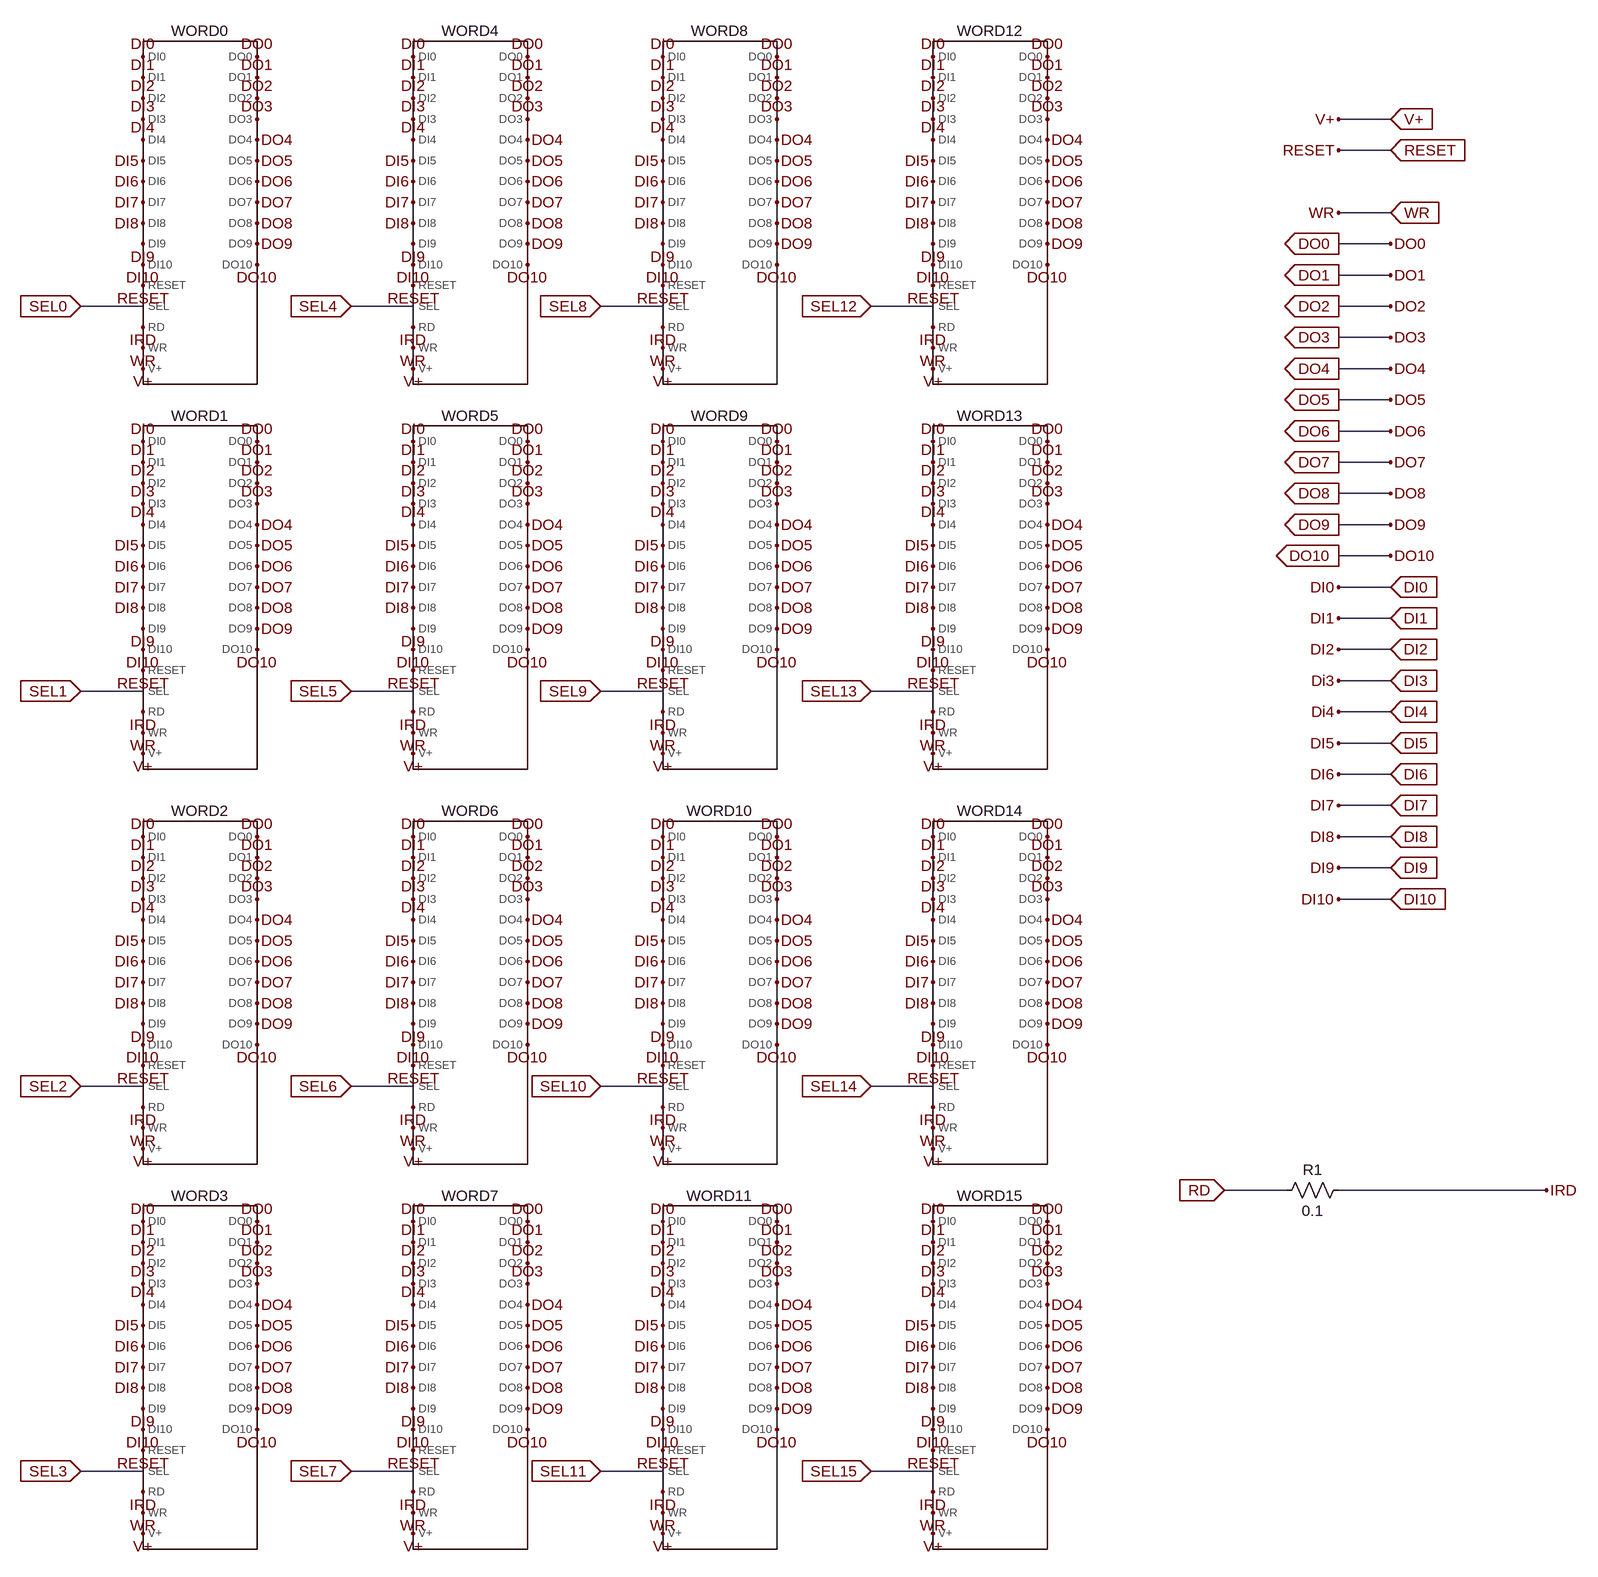
[diagram p0: schematic PMemBoard.asc]
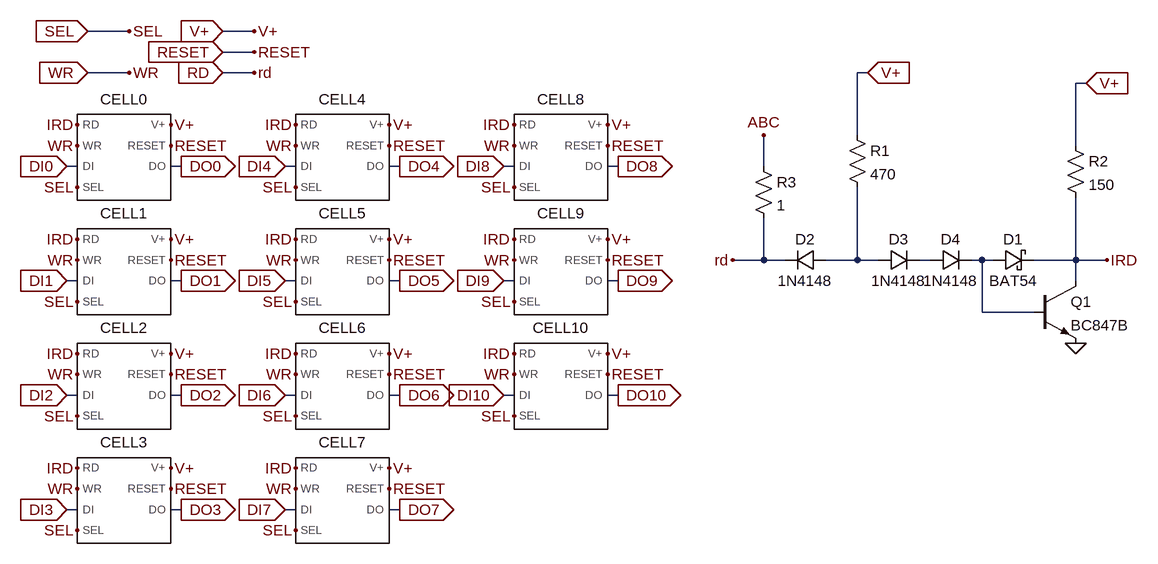
[diagram p1: sub-circuit pmemword.asc]
PMemBoard.asc, the LTspice schematic file:
Version 4
SHEET 1 2448 2400
WIRE 2128 176 2048 176
WIRE 2128 224 2048 224
WIRE 2128 320 2048 320
WIRE 2128 368 2048 368
WIRE 2128 416 2048 416
WIRE 208 464 112 464
WIRE 624 464 528 464
WIRE 1008 464 912 464
WIRE 1424 464 1328 464
WIRE 2128 464 2048 464
WIRE 2128 512 2048 512
WIRE 2128 560 2048 560
WIRE 2128 608 2048 608
WIRE 2128 656 2048 656
WIRE 2128 704 2048 704
WIRE 2128 752 2048 752
WIRE 2128 800 2048 800
WIRE 2128 848 2048 848
WIRE 2128 896 2048 896
WIRE 2128 944 2048 944
WIRE 2128 992 2048 992
WIRE 2128 1040 2048 1040
WIRE 208 1056 112 1056
WIRE 624 1056 528 1056
WIRE 1008 1056 912 1056
WIRE 1424 1056 1328 1056
WIRE 2128 1088 2048 1088
WIRE 2128 1136 2048 1136
WIRE 2128 1184 2048 1184
WIRE 2128 1232 2048 1232
WIRE 2128 1280 2048 1280
WIRE 2128 1328 2048 1328
WIRE 2128 1376 2048 1376
WIRE 208 1664 112 1664
WIRE 624 1664 528 1664
WIRE 1008 1664 912 1664
WIRE 1424 1664 1328 1664
WIRE 1968 1824 1872 1824
WIRE 2368 1824 2048 1824
WIRE 208 2256 112 2256
WIRE 624 2256 528 2256
WIRE 1008 2256 912 2256
WIRE 1424 2256 1328 2256
FLAG 208 560 V+
FLAG 208 432 RESET
FLAG 208 528 WR
FLAG 208 80 DI0
FLAG 208 112 DI1
FLAG 208 144 DI2
FLAG 208 176 DI3
FLAG 208 208 DI4
FLAG 208 240 DI5
FLAG 208 272 DI6
FLAG 208 304 DI7
FLAG 208 336 DI8
FLAG 208 368 DI9
FLAG 208 400 DI10
FLAG 384 80 DO0
FLAG 384 112 DO1
FLAG 384 144 DO2
FLAG 384 176 DO3
FLAG 384 208 DO4
FLAG 384 240 DO5
FLAG 384 272 DO6
FLAG 384 304 DO7
FLAG 384 336 DO8
FLAG 384 368 DO9
FLAG 384 400 DO10
FLAG 208 1152 V+
FLAG 208 1024 RESET
FLAG 208 1120 WR
FLAG 208 672 DI0
FLAG 208 704 DI1
FLAG 208 736 DI2
FLAG 208 768 DI3
FLAG 208 800 DI4
FLAG 208 832 DI5
FLAG 208 864 DI6
FLAG 208 896 DI7
FLAG 208 928 DI8
FLAG 208 960 DI9
FLAG 208 992 DI10
FLAG 384 672 DO0
FLAG 384 704 DO1
FLAG 384 736 DO2
FLAG 384 768 DO3
FLAG 384 800 DO4
FLAG 384 832 DO5
FLAG 384 864 DO6
FLAG 384 896 DO7
FLAG 384 928 DO8
FLAG 384 960 DO9
FLAG 384 992 DO10
FLAG 208 1760 V+
FLAG 208 1632 RESET
FLAG 208 1728 WR
FLAG 208 1280 DI0
FLAG 208 1312 DI1
FLAG 208 1344 DI2
FLAG 208 1376 DI3
FLAG 208 1408 DI4
FLAG 208 1440 DI5
FLAG 208 1472 DI6
FLAG 208 1504 DI7
FLAG 208 1536 DI8
FLAG 208 1568 DI9
FLAG 208 1600 DI10
FLAG 384 1280 DO0
FLAG 384 1312 DO1
FLAG 384 1344 DO2
FLAG 384 1376 DO3
FLAG 384 1408 DO4
FLAG 384 1440 DO5
FLAG 384 1472 DO6
FLAG 384 1504 DO7
FLAG 384 1536 DO8
FLAG 384 1568 DO9
FLAG 384 1600 DO10
FLAG 208 2352 V+
FLAG 208 2224 RESET
FLAG 208 2320 WR
FLAG 208 1872 DI0
FLAG 208 1904 DI1
FLAG 208 1936 DI2
FLAG 208 1968 DI3
FLAG 208 2000 DI4
FLAG 208 2032 DI5
FLAG 208 2064 DI6
FLAG 208 2096 DI7
FLAG 208 2128 DI8
FLAG 208 2160 DI9
FLAG 208 2192 DI10
FLAG 384 1872 DO0
FLAG 384 1904 DO1
FLAG 384 1936 DO2
FLAG 384 1968 DO3
FLAG 384 2000 DO4
FLAG 384 2032 DO5
FLAG 384 2064 DO6
FLAG 384 2096 DO7
FLAG 384 2128 DO8
FLAG 384 2160 DO9
FLAG 384 2192 DO10
FLAG 624 560 V+
FLAG 624 432 RESET
FLAG 624 528 WR
FLAG 624 80 DI0
FLAG 624 112 DI1
FLAG 624 144 DI2
FLAG 624 176 DI3
FLAG 624 208 DI4
FLAG 624 240 DI5
FLAG 624 272 DI6
FLAG 624 304 DI7
FLAG 624 336 DI8
FLAG 624 368 DI9
FLAG 624 400 DI10
FLAG 800 80 DO0
FLAG 800 112 DO1
FLAG 800 144 DO2
FLAG 800 176 DO3
FLAG 800 208 DO4
FLAG 800 240 DO5
FLAG 800 272 DO6
FLAG 800 304 DO7
FLAG 800 336 DO8
FLAG 800 368 DO9
FLAG 800 400 DO10
FLAG 624 1152 V+
FLAG 624 1024 RESET
FLAG 624 1120 WR
FLAG 624 672 DI0
FLAG 624 704 DI1
FLAG 624 736 DI2
FLAG 624 768 DI3
FLAG 624 800 DI4
FLAG 624 832 DI5
FLAG 624 864 DI6
FLAG 624 896 DI7
FLAG 624 928 DI8
FLAG 624 960 DI9
FLAG 624 992 DI10
FLAG 800 672 DO0
FLAG 800 704 DO1
FLAG 800 736 DO2
FLAG 800 768 DO3
FLAG 800 800 DO4
FLAG 800 832 DO5
FLAG 800 864 DO6
FLAG 800 896 DO7
FLAG 800 928 DO8
FLAG 800 960 DO9
FLAG 800 992 DO10
FLAG 624 1760 V+
FLAG 624 1632 RESET
FLAG 624 1728 WR
FLAG 624 1280 DI0
FLAG 624 1312 DI1
FLAG 624 1344 DI2
FLAG 624 1376 DI3
FLAG 624 1408 DI4
FLAG 624 1440 DI5
FLAG 624 1472 DI6
FLAG 624 1504 DI7
FLAG 624 1536 DI8
FLAG 624 1568 DI9
FLAG 624 1600 DI10
FLAG 800 1280 DO0
FLAG 800 1312 DO1
FLAG 800 1344 DO2
FLAG 800 1376 DO3
FLAG 800 1408 DO4
FLAG 800 1440 DO5
FLAG 800 1472 DO6
FLAG 800 1504 DO7
FLAG 800 1536 DO8
FLAG 800 1568 DO9
FLAG 800 1600 DO10
FLAG 624 2352 V+
FLAG 624 2224 RESET
FLAG 624 2320 WR
FLAG 624 1872 DI0
FLAG 624 1904 DI1
FLAG 624 1936 DI2
FLAG 624 1968 DI3
FLAG 624 2000 DI4
FLAG 624 2032 DI5
FLAG 624 2064 DI6
FLAG 624 2096 DI7
FLAG 624 2128 DI8
FLAG 624 2160 DI9
FLAG 624 2192 DI10
FLAG 800 1872 DO0
FLAG 800 1904 DO1
FLAG 800 1936 DO2
FLAG 800 1968 DO3
FLAG 800 2000 DO4
FLAG 800 2032 DO5
FLAG 800 2064 DO6
FLAG 800 2096 DO7
FLAG 800 2128 DO8
FLAG 800 2160 DO9
FLAG 800 2192 DO10
FLAG 1008 560 V+
FLAG 1008 432 RESET
FLAG 1008 528 WR
FLAG 1008 80 DI0
FLAG 1008 112 DI1
FLAG 1008 144 DI2
FLAG 1008 176 DI3
FLAG 1008 208 DI4
FLAG 1008 240 DI5
FLAG 1008 272 DI6
FLAG 1008 304 DI7
FLAG 1008 336 DI8
FLAG 1008 368 DI9
FLAG 1008 400 DI10
FLAG 1184 80 DO0
FLAG 1184 112 DO1
FLAG 1184 144 DO2
FLAG 1184 176 DO3
FLAG 1184 208 DO4
FLAG 1184 240 DO5
FLAG 1184 272 DO6
FLAG 1184 304 DO7
FLAG 1184 336 DO8
FLAG 1184 368 DO9
FLAG 1184 400 DO10
FLAG 1008 1152 V+
FLAG 1008 1024 RESET
FLAG 1008 1120 WR
FLAG 1008 672 DI0
FLAG 1008 704 DI1
FLAG 1008 736 DI2
FLAG 1008 768 DI3
FLAG 1008 800 DI4
FLAG 1008 832 DI5
FLAG 1008 864 DI6
FLAG 1008 896 DI7
FLAG 1008 928 DI8
FLAG 1008 960 DI9
FLAG 1008 992 DI10
FLAG 1184 672 DO0
FLAG 1184 704 DO1
FLAG 1184 736 DO2
FLAG 1184 768 DO3
FLAG 1184 800 DO4
FLAG 1184 832 DO5
FLAG 1184 864 DO6
FLAG 1184 896 DO7
FLAG 1184 928 DO8
FLAG 1184 960 DO9
FLAG 1184 992 DO10
FLAG 1008 1760 V+
FLAG 1008 1632 RESET
FLAG 1008 1728 WR
FLAG 1008 1280 DI0
FLAG 1008 1312 DI1
FLAG 1008 1344 DI2
FLAG 1008 1376 DI3
FLAG 1008 1408 DI4
FLAG 1008 1440 DI5
FLAG 1008 1472 DI6
FLAG 1008 1504 DI7
FLAG 1008 1536 DI8
FLAG 1008 1568 DI9
FLAG 1008 1600 DI10
FLAG 1184 1280 DO0
FLAG 1184 1312 DO1
FLAG 1184 1344 DO2
FLAG 1184 1376 DO3
FLAG 1184 1408 DO4
FLAG 1184 1440 DO5
FLAG 1184 1472 DO6
FLAG 1184 1504 DO7
FLAG 1184 1536 DO8
FLAG 1184 1568 DO9
FLAG 1184 1600 DO10
FLAG 1008 2352 V+
FLAG 1008 2224 RESET
FLAG 1008 2320 WR
FLAG 1008 1872 DI0
FLAG 1008 1904 DI1
FLAG 1008 1936 DI2
FLAG 1008 1968 DI3
FLAG 1008 2000 DI4
FLAG 1008 2032 DI5
FLAG 1008 2064 DI6
FLAG 1008 2096 DI7
FLAG 1008 2128 DI8
FLAG 1008 2160 DI9
FLAG 1008 2192 DI10
FLAG 1184 1872 DO0
FLAG 1184 1904 DO1
FLAG 1184 1936 DO2
FLAG 1184 1968 DO3
FLAG 1184 2000 DO4
FLAG 1184 2032 DO5
FLAG 1184 2064 DO6
FLAG 1184 2096 DO7
FLAG 1184 2128 DO8
FLAG 1184 2160 DO9
FLAG 1184 2192 DO10
FLAG 1424 560 V+
FLAG 1424 432 RESET
FLAG 1424 528 WR
FLAG 1424 80 DI0
FLAG 1424 112 DI1
FLAG 1424 144 DI2
FLAG 1424 176 DI3
FLAG 1424 208 DI4
FLAG 1424 240 DI5
FLAG 1424 272 DI6
FLAG 1424 304 DI7
FLAG 1424 336 DI8
FLAG 1424 368 DI9
FLAG 1424 400 DI10
FLAG 1600 80 DO0
FLAG 1600 112 DO1
FLAG 1600 144 DO2
FLAG 1600 176 DO3
FLAG 1600 208 DO4
FLAG 1600 240 DO5
FLAG 1600 272 DO6
FLAG 1600 304 DO7
FLAG 1600 336 DO8
FLAG 1600 368 DO9
FLAG 1600 400 DO10
FLAG 1424 1152 V+
FLAG 1424 1024 RESET
FLAG 1424 1120 WR
FLAG 1424 672 DI0
FLAG 1424 704 DI1
FLAG 1424 736 DI2
FLAG 1424 768 DI3
FLAG 1424 800 DI4
FLAG 1424 832 DI5
FLAG 1424 864 DI6
FLAG 1424 896 DI7
FLAG 1424 928 DI8
FLAG 1424 960 DI9
FLAG 1424 992 DI10
FLAG 1600 672 DO0
FLAG 1600 704 DO1
FLAG 1600 736 DO2
FLAG 1600 768 DO3
FLAG 1600 800 DO4
FLAG 1600 832 DO5
FLAG 1600 864 DO6
FLAG 1600 896 DO7
FLAG 1600 928 DO8
FLAG 1600 960 DO9
FLAG 1600 992 DO10
FLAG 1424 1760 V+
FLAG 1424 1632 RESET
FLAG 1424 1728 WR
FLAG 1424 1280 DI0
FLAG 1424 1312 DI1
FLAG 1424 1344 DI2
FLAG 1424 1376 DI3
FLAG 1424 1408 DI4
FLAG 1424 1440 DI5
FLAG 1424 1472 DI6
FLAG 1424 1504 DI7
FLAG 1424 1536 DI8
FLAG 1424 1568 DI9
FLAG 1424 1600 DI10
FLAG 1600 1280 DO0
FLAG 1600 1312 DO1
FLAG 1600 1344 DO2
FLAG 1600 1376 DO3
FLAG 1600 1408 DO4
FLAG 1600 1440 DO5
FLAG 1600 1472 DO6
FLAG 1600 1504 DO7
FLAG 1600 1536 DO8
FLAG 1600 1568 DO9
FLAG 1600 1600 DO10
FLAG 1424 2352 V+
FLAG 1424 2224 RESET
FLAG 1424 2320 WR
FLAG 1424 1872 DI0
FLAG 1424 1904 DI1
FLAG 1424 1936 DI2
FLAG 1424 1968 DI3
FLAG 1424 2000 DI4
FLAG 1424 2032 DI5
FLAG 1424 2064 DI6
FLAG 1424 2096 DI7
FLAG 1424 2128 DI8
FLAG 1424 2160 DI9
FLAG 1424 2192 DI10
FLAG 1600 1872 DO0
FLAG 1600 1904 DO1
FLAG 1600 1936 DO2
FLAG 1600 1968 DO3
FLAG 1600 2000 DO4
FLAG 1600 2032 DO5
FLAG 1600 2064 DO6
FLAG 1600 2096 DO7
FLAG 1600 2128 DO8
FLAG 1600 2160 DO9
FLAG 1600 2192 DO10
FLAG 2048 176 V+
FLAG 2128 176 V+
IOPIN 2128 176 In
FLAG 2048 224 RESET
FLAG 2128 224 RESET
IOPIN 2128 224 In
FLAG 1872 1824 RD
IOPIN 1872 1824 In
FLAG 2048 320 WR
FLAG 2128 320 WR
IOPIN 2128 320 In
FLAG 2048 368 DO0
IOPIN 2048 368 Out
FLAG 2128 368 DO0
FLAG 2048 416 DO1
IOPIN 2048 416 Out
FLAG 2128 416 DO1
FLAG 2048 464 DO2
IOPIN 2048 464 Out
FLAG 2128 464 DO2
FLAG 2048 512 DO3
IOPIN 2048 512 Out
FLAG 2128 512 DO3
FLAG 2048 560 DO4
IOPIN 2048 560 Out
FLAG 2128 560 DO4
FLAG 2048 608 DO5
IOPIN 2048 608 Out
FLAG 2128 608 DO5
FLAG 2048 656 DO6
IOPIN 2048 656 Out
FLAG 2128 656 DO6
FLAG 2048 704 DO7
IOPIN 2048 704 Out
FLAG 2128 704 DO7
FLAG 2048 752 DO8
IOPIN 2048 752 Out
FLAG 2128 752 DO8
FLAG 2048 800 DO9
IOPIN 2048 800 Out
FLAG 2128 800 DO9
FLAG 2048 848 DO10
IOPIN 2048 848 Out
FLAG 2128 848 DO10
FLAG 2048 896 DI0
FLAG 2128 896 DI0
IOPIN 2128 896 In
FLAG 2048 944 DI1
FLAG 2128 944 DI1
IOPIN 2128 944 In
FLAG 2048 992 DI2
FLAG 2128 992 DI2
IOPIN 2128 992 In
FLAG 2048 1040 Di3
FLAG 2128 1040 DI3
IOPIN 2128 1040 In
FLAG 2048 1088 Di4
FLAG 2128 1088 DI4
IOPIN 2128 1088 In
FLAG 2048 1136 DI5
FLAG 2128 1136 DI5
IOPIN 2128 1136 In
FLAG 2048 1184 DI6
FLAG 2128 1184 DI6
IOPIN 2128 1184 In
FLAG 2048 1232 DI7
FLAG 2128 1232 DI7
IOPIN 2128 1232 In
FLAG 2048 1280 DI8
FLAG 2128 1280 DI8
IOPIN 2128 1280 In
FLAG 2048 1328 DI9
FLAG 2128 1328 DI9
IOPIN 2128 1328 In
FLAG 2048 1376 DI10
FLAG 2128 1376 DI10
IOPIN 2128 1376 In
FLAG 112 464 SEL0
IOPIN 112 464 In
FLAG 112 1056 SEL1
IOPIN 112 1056 In
FLAG 112 1664 SEL2
IOPIN 112 1664 In
FLAG 528 464 SEL4
IOPIN 528 464 In
FLAG 912 464 SEL8
IOPIN 912 464 In
FLAG 1328 464 SEL12
IOPIN 1328 464 In
FLAG 1328 1056 SEL13
IOPIN 1328 1056 In
FLAG 912 1056 SEL9
IOPIN 912 1056 In
FLAG 528 1056 SEL5
IOPIN 528 1056 In
FLAG 528 1664 SEL6
IOPIN 528 1664 In
FLAG 912 1664 SEL10
IOPIN 912 1664 In
FLAG 1328 1664 SEL14
IOPIN 1328 1664 In
FLAG 1328 2256 SEL15
IOPIN 1328 2256 In
FLAG 912 2256 SEL11
IOPIN 912 2256 In
FLAG 528 2256 SEL7
IOPIN 528 2256 In
FLAG 112 2256 SEL3
IOPIN 112 2256 In
FLAG 208 496 IRD
FLAG 624 496 IRD
FLAG 1008 496 IRD
FLAG 1424 496 IRD
FLAG 1424 1088 IRD
FLAG 1008 1088 IRD
FLAG 624 1088 IRD
FLAG 208 1088 IRD
FLAG 1424 2288 IRD
FLAG 1008 2288 IRD
FLAG 624 2288 IRD
FLAG 208 2288 IRD
FLAG 208 1696 IRD
FLAG 624 1696 IRD
FLAG 1008 1696 IRD
FLAG 1424 1696 IRD
FLAG 2368 1824 IRD
SYMBOL PMemWord 288 320 R0
SYMATTR InstName WORD0
SYMBOL PMemWord 288 912 R0
SYMATTR InstName WORD1
SYMBOL PMemWord 288 1520 R0
SYMATTR InstName WORD2
SYMBOL PMemWord 288 2112 R0
SYMATTR InstName WORD3
SYMBOL PMemWord 704 320 R0
SYMATTR InstName WORD4
SYMBOL PMemWord 704 912 R0
SYMATTR InstName WORD5
SYMBOL PMemWord 704 1520 R0
SYMATTR InstName WORD6
SYMBOL PMemWord 704 2112 R0
SYMATTR InstName WORD7
SYMBOL PMemWord 1088 320 R0
SYMATTR InstName WORD8
SYMBOL PMemWord 1088 912 R0
SYMATTR InstName WORD9
SYMBOL PMemWord 1088 1520 R0
SYMATTR InstName WORD10
SYMBOL PMemWord 1088 2112 R0
SYMATTR InstName WORD11
SYMBOL PMemWord 1504 320 R0
SYMATTR InstName WORD12
SYMBOL PMemWord 1504 912 R0
SYMATTR InstName WORD13
SYMBOL PMemWord 1504 1520 R0
SYMATTR InstName WORD14
SYMBOL PMemWord 1504 2112 R0
SYMATTR InstName WORD15
SYMBOL res 2064 1808 R90
WINDOW 0 0 56 VBottom 2
WINDOW 3 32 56 VTop 2
SYMATTR InstName R1
SYMATTR Value 0.1

pmemword.asc, the sub-circuit schematic file:
Version 4
SHEET 1 1744 2248
WIRE 192 80 128 80
WIRE 384 80 336 80
WIRE 384 112 336 112
WIRE 192 144 128 144
WIRE 384 144 336 144
WIRE 1328 144 1312 144
WIRE 1664 160 1648 160
WIRE 1312 240 1312 144
WIRE 1648 256 1648 160
WIRE 112 288 96 288
WIRE 272 288 256 288
WIRE 448 288 432 288
WIRE 608 288 592 288
WIRE 784 288 768 288
WIRE 944 288 928 288
WIRE 1168 288 1168 240
WIRE 1168 432 1168 368
WIRE 1168 432 1120 432
WIRE 1200 432 1168 432
WIRE 1312 432 1312 320
WIRE 1312 432 1264 432
WIRE 1344 432 1312 432
WIRE 1424 432 1408 432
WIRE 1504 432 1488 432
WIRE 1520 432 1504 432
WIRE 1648 432 1648 336
WIRE 1648 432 1584 432
WIRE 1696 432 1648 432
WIRE 112 464 96 464
WIRE 272 464 256 464
WIRE 448 464 432 464
WIRE 608 464 592 464
WIRE 784 464 768 464
WIRE 944 464 928 464
WIRE 1648 464 1648 432
WIRE 1504 512 1504 432
WIRE 1584 512 1504 512
WIRE 112 640 96 640
WIRE 272 640 256 640
WIRE 448 640 432 640
WIRE 608 640 592 640
WIRE 784 640 768 640
WIRE 944 640 928 640
WIRE 112 816 96 816
WIRE 272 816 256 816
WIRE 448 816 432 816
WIRE 608 816 592 816
FLAG 256 224 V+
FLAG 256 256 RESET
FLAG 96 288 DI0
IOPIN 96 288 In
FLAG 272 288 DO0
IOPIN 272 288 Out
FLAG 112 224 IRD
FLAG 112 256 WR
FLAG 112 320 SEL
FLAG 128 80 SEL
IOPIN 128 80 In
FLAG 192 80 SEL
FLAG 336 144 RD
IOPIN 336 144 In
FLAG 128 144 WR
IOPIN 128 144 In
FLAG 192 144 WR
FLAG 336 80 V+
IOPIN 336 80 In
FLAG 384 80 V+
FLAG 336 112 RESET
IOPIN 336 112 In
FLAG 384 112 RESET
FLAG 256 400 V+
FLAG 256 432 RESET
FLAG 96 464 DI1
IOPIN 96 464 In
FLAG 272 464 DO1
IOPIN 272 464 Out
FLAG 112 400 IRD
FLAG 112 432 WR
FLAG 112 496 SEL
FLAG 256 576 V+
FLAG 256 608 RESET
FLAG 96 640 DI2
IOPIN 96 640 In
FLAG 272 640 DO2
IOPIN 272 640 Out
FLAG 112 576 IRD
FLAG 112 608 WR
FLAG 112 672 SEL
FLAG 256 752 V+
FLAG 256 784 RESET
FLAG 96 816 DI3
IOPIN 96 816 In
FLAG 272 816 DO3
IOPIN 272 816 Out
FLAG 112 752 IRD
FLAG 112 784 WR
FLAG 112 848 SEL
FLAG 592 224 V+
FLAG 592 256 RESET
FLAG 432 288 DI4
IOPIN 432 288 In
FLAG 608 288 DO4
IOPIN 608 288 Out
FLAG 448 224 IRD
FLAG 448 256 WR
FLAG 448 320 SEL
FLAG 592 400 V+
FLAG 592 432 RESET
FLAG 432 464 DI5
IOPIN 432 464 In
FLAG 608 464 DO5
IOPIN 608 464 Out
FLAG 448 400 IRD
FLAG 448 432 WR
FLAG 448 496 SEL
FLAG 592 576 V+
FLAG 592 608 RESET
FLAG 432 640 DI6
IOPIN 432 640 In
FLAG 608 640 DO6
IOPIN 608 640 Out
FLAG 448 576 IRD
FLAG 448 608 WR
FLAG 448 672 SEL
FLAG 592 752 V+
FLAG 592 784 RESET
FLAG 432 816 DI7
IOPIN 432 816 In
FLAG 608 816 DO7
IOPIN 608 816 Out
FLAG 448 752 IRD
FLAG 448 784 WR
FLAG 448 848 SEL
FLAG 928 224 V+
FLAG 928 256 RESET
FLAG 768 288 DI8
IOPIN 768 288 In
FLAG 944 288 DO8
IOPIN 944 288 Out
FLAG 784 224 IRD
FLAG 784 256 WR
FLAG 784 320 SEL
FLAG 928 400 V+
FLAG 928 432 RESET
FLAG 768 464 DI9
IOPIN 768 464 In
FLAG 944 464 DO9
IOPIN 944 464 Out
FLAG 784 400 IRD
FLAG 784 432 WR
FLAG 784 496 SEL
FLAG 928 576 V+
FLAG 928 608 RESET
FLAG 768 640 DI10
IOPIN 768 640 In
FLAG 944 640 DO10
IOPIN 944 640 Out
FLAG 784 576 IRD
FLAG 784 608 WR
FLAG 784 672 SEL
FLAG 1648 560 0
FLAG 1328 144 V+
IOPIN 1328 144 In
FLAG 1664 160 V+
IOPIN 1664 160 In
FLAG 1696 432 IRD
FLAG 384 144 rd
FLAG 1120 432 rd
FLAG 1168 240 ABC
SYMBOL PMemCell 176 272 R0
SYMATTR InstName CELL0
SYMBOL PMemCell 176 448 R0
SYMATTR InstName CELL1
SYMBOL PMemCell 176 624 R0
SYMATTR InstName CELL2
SYMBOL PMemCell 176 800 R0
SYMATTR InstName CELL3
SYMBOL PMemCell 512 272 R0
SYMATTR InstName CELL4
SYMBOL PMemCell 512 448 R0
SYMATTR InstName CELL5
SYMBOL PMemCell 512 624 R0
SYMATTR InstName CELL6
SYMBOL PMemCell 512 800 R0
SYMATTR InstName CELL7
SYMBOL PMemCell 848 272 R0
SYMATTR InstName CELL8
SYMBOL PMemCell 848 448 R0
SYMATTR InstName CELL9
SYMBOL PMemCell 848 624 R0
SYMATTR InstName CELL10
SYMBOL npn 1584 464 R0
SYMATTR InstName Q1
SYMATTR Value BC847B
SYMBOL schottky 1520 448 R270
WINDOW 0 32 32 VTop 2
WINDOW 3 0 32 VBottom 2
SYMATTR InstName D1
SYMATTR Value BAT54
SYMATTR Description Diode
SYMATTR Type diode
SYMBOL diode 1264 448 M270
WINDOW 0 32 32 VTop 2
WINDOW 3 0 32 VBottom 2
SYMATTR InstName D2
SYMATTR Value 1N4148
SYMBOL res 1296 224 R0
SYMATTR InstName R1
SYMATTR Value 470
SYMBOL diode 1344 416 M90
WINDOW 0 0 32 VBottom 2
WINDOW 3 32 32 VTop 2
SYMATTR InstName D3
SYMATTR Value 1N4148
SYMBOL diode 1424 416 M90
WINDOW 0 0 32 VBottom 2
WINDOW 3 32 32 VTop 2
SYMATTR InstName D4
SYMATTR Value 1N4148
SYMBOL res 1632 240 R0
SYMATTR InstName R2
SYMATTR Value 150
SYMBOL res 1152 272 R0
SYMATTR InstName R3
SYMATTR Value 1

The netlist it stands for:
* PMemBoard.asc
XWORD0 DI0 DI1 DI10 DI2 DI3 DI4 DI5 DI6 DI7 DI8 DI9 IRD RESET SEL0 V+ WR DO0 DO1 DO10 DO2 DO3 DO4 DO5 DO6 DO7 DO8 DO9 pmemword
XWORD1 DI0 DI1 DI10 DI2 DI3 DI4 DI5 DI6 DI7 DI8 DI9 IRD RESET SEL1 V+ WR DO0 DO1 DO10 DO2 DO3 DO4 DO5 DO6 DO7 DO8 DO9 pmemword
XWORD2 DI0 DI1 DI10 DI2 DI3 DI4 DI5 DI6 DI7 DI8 DI9 IRD RESET SEL2 V+ WR DO0 DO1 DO10 DO2 DO3 DO4 DO5 DO6 DO7 DO8 DO9 pmemword
XWORD3 DI0 DI1 DI10 DI2 DI3 DI4 DI5 DI6 DI7 DI8 DI9 IRD RESET SEL3 V+ WR DO0 DO1 DO10 DO2 DO3 DO4 DO5 DO6 DO7 DO8 DO9 pmemword
XWORD4 DI0 DI1 DI10 DI2 DI3 DI4 DI5 DI6 DI7 DI8 DI9 IRD RESET SEL4 V+ WR DO0 DO1 DO10 DO2 DO3 DO4 DO5 DO6 DO7 DO8 DO9 pmemword
XWORD5 DI0 DI1 DI10 DI2 DI3 DI4 DI5 DI6 DI7 DI8 DI9 IRD RESET SEL5 V+ WR DO0 DO1 DO10 DO2 DO3 DO4 DO5 DO6 DO7 DO8 DO9 pmemword
XWORD6 DI0 DI1 DI10 DI2 DI3 DI4 DI5 DI6 DI7 DI8 DI9 IRD RESET SEL6 V+ WR DO0 DO1 DO10 DO2 DO3 DO4 DO5 DO6 DO7 DO8 DO9 pmemword
XWORD7 DI0 DI1 DI10 DI2 DI3 DI4 DI5 DI6 DI7 DI8 DI9 IRD RESET SEL7 V+ WR DO0 DO1 DO10 DO2 DO3 DO4 DO5 DO6 DO7 DO8 DO9 pmemword
XWORD8 DI0 DI1 DI10 DI2 DI3 DI4 DI5 DI6 DI7 DI8 DI9 IRD RESET SEL8 V+ WR DO0 DO1 DO10 DO2 DO3 DO4 DO5 DO6 DO7 DO8 DO9 pmemword
XWORD9 DI0 DI1 DI10 DI2 DI3 DI4 DI5 DI6 DI7 DI8 DI9 IRD RESET SEL9 V+ WR DO0 DO1 DO10 DO2 DO3 DO4 DO5 DO6 DO7 DO8 DO9 pmemword
XWORD10 DI0 DI1 DI10 DI2 DI3 DI4 DI5 DI6 DI7 DI8 DI9 IRD RESET SEL10 V+ WR DO0 DO1 DO10 DO2 DO3 DO4 DO5 DO6 DO7 DO8 DO9 pmemword
XWORD11 DI0 DI1 DI10 DI2 DI3 DI4 DI5 DI6 DI7 DI8 DI9 IRD RESET SEL11 V+ WR DO0 DO1 DO10 DO2 DO3 DO4 DO5 DO6 DO7 DO8 DO9 pmemword
XWORD12 DI0 DI1 DI10 DI2 DI3 DI4 DI5 DI6 DI7 DI8 DI9 IRD RESET SEL12 V+ WR DO0 DO1 DO10 DO2 DO3 DO4 DO5 DO6 DO7 DO8 DO9 pmemword
XWORD13 DI0 DI1 DI10 DI2 DI3 DI4 DI5 DI6 DI7 DI8 DI9 IRD RESET SEL13 V+ WR DO0 DO1 DO10 DO2 DO3 DO4 DO5 DO6 DO7 DO8 DO9 pmemword
XWORD14 DI0 DI1 DI10 DI2 DI3 DI4 DI5 DI6 DI7 DI8 DI9 IRD RESET SEL14 V+ WR DO0 DO1 DO10 DO2 DO3 DO4 DO5 DO6 DO7 DO8 DO9 pmemword
XWORD15 DI0 DI1 DI10 DI2 DI3 DI4 DI5 DI6 DI7 DI8 DI9 IRD RESET SEL15 V+ WR DO0 DO1 DO10 DO2 DO3 DO4 DO5 DO6 DO7 DO8 DO9 pmemword
R1 IRD RD 0.1

* block symbol definitions
.subckt pmemword DI0 DI1 DI10 DI2 DI3 DI4 DI5 DI6 DI7 DI8 DI9 RD RESET SEL V+ WR DO0 DO1 DO10 DO2 DO3 DO4 DO5 DO6 DO7 DO8 DO9
XCELL0 IRD RESET DI0 V+ DO0 WR SEL PMemCell  ; pins RD RESET DI V+ DO WR SEL
XCELL1 IRD RESET DI1 V+ DO1 WR SEL PMemCell  ; pins RD RESET DI V+ DO WR SEL
XCELL2 IRD RESET DI2 V+ DO2 WR SEL PMemCell  ; pins RD RESET DI V+ DO WR SEL
XCELL3 IRD RESET DI3 V+ DO3 WR SEL PMemCell  ; pins RD RESET DI V+ DO WR SEL
XCELL4 IRD RESET DI4 V+ DO4 WR SEL PMemCell  ; pins RD RESET DI V+ DO WR SEL
XCELL5 IRD RESET DI5 V+ DO5 WR SEL PMemCell  ; pins RD RESET DI V+ DO WR SEL
XCELL6 IRD RESET DI6 V+ DO6 WR SEL PMemCell  ; pins RD RESET DI V+ DO WR SEL
XCELL7 IRD RESET DI7 V+ DO7 WR SEL PMemCell  ; pins RD RESET DI V+ DO WR SEL
XCELL8 IRD RESET DI8 V+ DO8 WR SEL PMemCell  ; pins RD RESET DI V+ DO WR SEL
XCELL9 IRD RESET DI9 V+ DO9 WR SEL PMemCell  ; pins RD RESET DI V+ DO WR SEL
XCELL10 IRD RESET DI10 V+ DO10 WR SEL PMemCell  ; pins RD RESET DI V+ DO WR SEL
Q1 IRD N003 0 0 BC847B
D1 N003 IRD BAT54
D2 N001 RD 1N4148
R1 V+ N001 470
D3 N001 N002 1N4148
D4 N002 N003 1N4148
R2 V+ IRD 150
R3 ABC RD 1
.ends pmemword

.model D D
.lib standard.dio
.model NPN NPN
.model PNP PNP
.lib standard.bjt
.backanno
.end